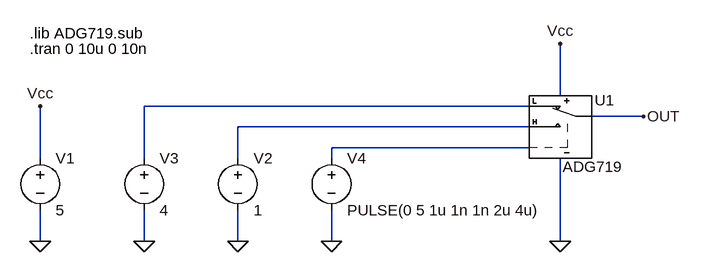
[diagram p0: schematic Test.asc]
Test.asc, the LTspice schematic file:
Version 4
SHEET 1 1144 680
WIRE 384 112 384 32
WIRE 336 128 -256 128
WIRE 512 144 432 144
WIRE 336 160 -112 160
WIRE 336 192 32 192
WIRE -416 208 -416 128
WIRE -256 208 -256 128
WIRE -112 208 -112 160
WIRE 32 208 32 192
WIRE -416 336 -416 288
WIRE -256 336 -256 288
WIRE -112 336 -112 288
WIRE 32 336 32 288
WIRE 384 336 384 208
FLAG 384 336 0
FLAG 384 32 Vcc
FLAG -416 336 0
FLAG -256 336 0
FLAG 32 336 0
FLAG -416 128 Vcc
FLAG 512 144 OUT
FLAG -112 336 0
SYMBOL voltage -416 192 R0
WINDOW 123 0 0 Left 2
WINDOW 39 0 0 Left 2
SYMATTR InstName V1
SYMATTR Value 5
SYMBOL voltage -256 192 R0
WINDOW 123 0 0 Left 2
WINDOW 39 0 0 Left 2
SYMATTR InstName V3
SYMATTR Value 4
SYMBOL voltage 32 192 R0
WINDOW 123 0 0 Left 2
WINDOW 39 0 0 Left 2
SYMATTR InstName V4
SYMATTR Value PULSE(0 5 1u 1n 1n 2u 4u)
SYMBOL ADG719 336 112 R0
SYMATTR InstName U1
SYMBOL voltage -112 192 R0
WINDOW 123 0 0 Left 2
WINDOW 39 0 0 Left 2
SYMATTR InstName V2
SYMATTR Value 1
TEXT -432 40 Left 2 !.tran 0 10u 0 10n
TEXT -432 16 Left 2 !.lib ADG719.sub

The netlist it stands for:
* Test.asc
V1 Vcc 0 5
V3 N001 0 4
V4 N003 0 PULSE(0 5 1u 1n 1n 2u 4u)
XU1 N003 Vcc 0 N001 OUT N002 ADG719  ; pins NC+ V+ V- S1 D S2
V2 N002 0 1
.tran 0 10u 0 10n
.lib ADG719.sub
.backanno
.end